# Altium schematic sheet ESP32-DEVKITC-32D.SchDoc
size A
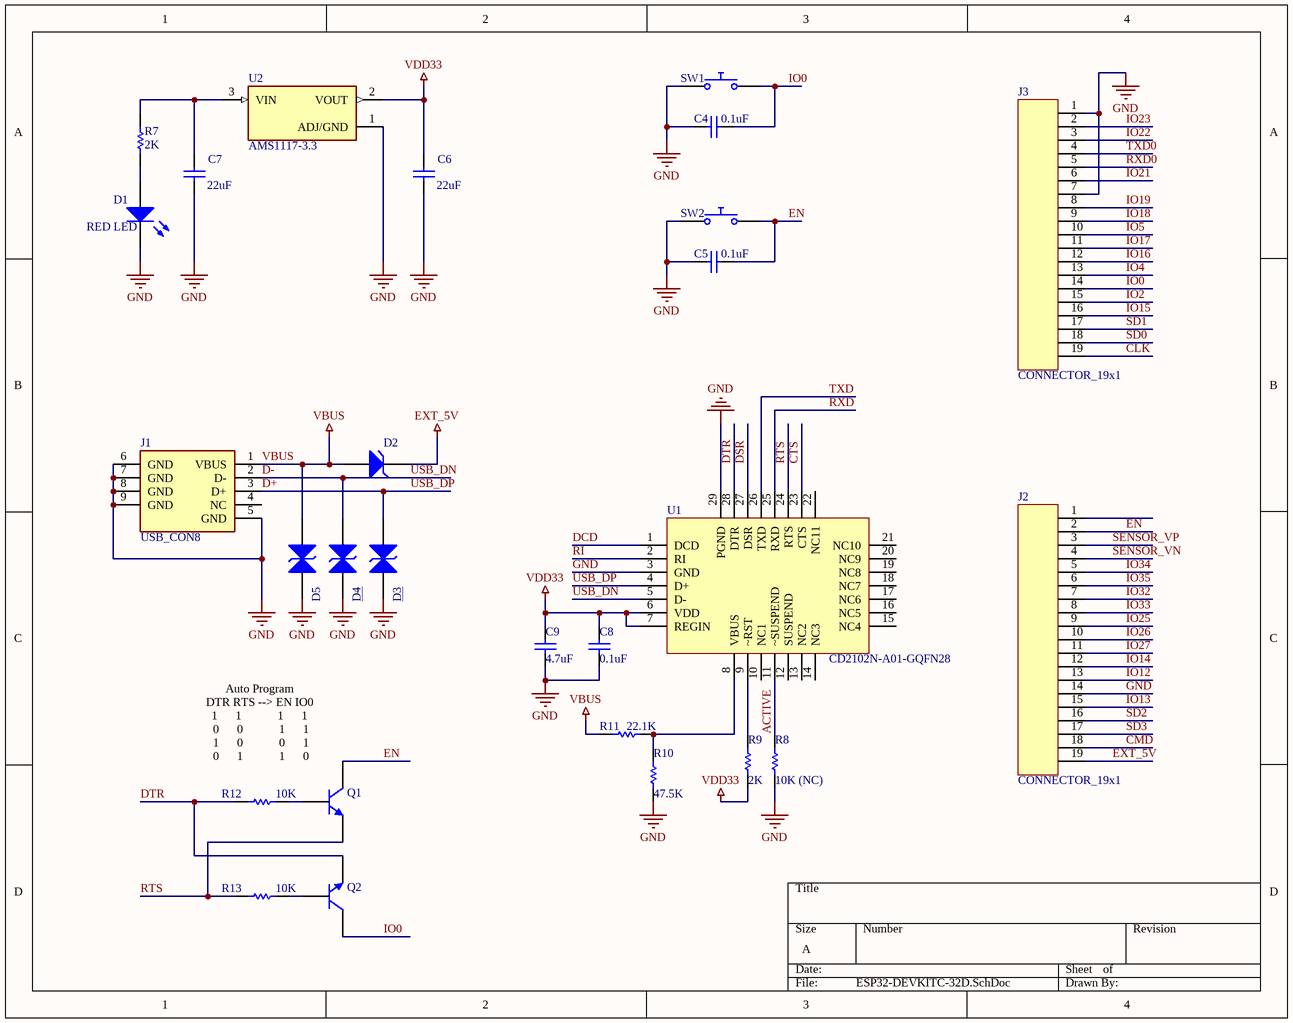
[diagram p0: ESP32-DEVKITC-32D.SchDoc]

## Parts
C4  value 0.1uF  (hidden comment: Capacitor)
C5  value 0.1uF  (hidden comment: Capacitor)
C6  value 22uF  (hidden comment: Capacitor)
C7  value 22uF  (hidden comment: Capacitor)
C8  value 0.1uF  (hidden comment: Capacitor)
C9  value 4.7uF  (hidden comment: Capacitor)
D1  RED LED
D2  Zener Diode  (value not drawn)
D3  Suppressor Dual  (value not drawn)
D4  Suppressor Dual  (value not drawn)
D5  Suppressor Dual  (value not drawn)
J1  USB_CON8
J2  CONNECTOR_19x1  [HDR1X19]
J3  CONNECTOR_19x1  [HDR1X19]
Q1  Bipolar  NPN 3 Pins  Transistor   Gummel-Poon Model  (value not drawn)
Q2  Bipolar  NPN 3 Pins  Transistor   Gummel-Poon Model  (value not drawn)
R7  value 2K  (hidden comment: Resistor)
R8  value 10K (NC)  (hidden comment: Resistor)
R9  value 2K  (hidden comment: Resistor)
R10  value 47.5K  (hidden comment: Resistor)
R11  value 22.1K  (hidden comment: Resistor)
R12  value 10K  (hidden comment: Resistor)
R13  value 10K  (hidden comment: Resistor)
SW1  Push Button Normally Opened  (value not drawn)
SW2  Push Button Normally Opened  (value not drawn)
U1  CD2102N-A01-GQFN28
U2  AMS1117-3.3  [SOT229P700X180-4N]

## Nets
EXT_5V: D2.2(K) J2.19
GND: C4.1 C5.1 C6.1 C7.1 C8.1 C9.1 D1.2(K) D3.1 D4.1 D5.1 J1.5(GND) J1.6(GND) J1.7(GND) J1.8(GND) J1.9(GND) J2.14 J3.1 J3.7 R8.1 R10.1 SW1.1 SW2.1 U1.3(GND) U1.29(PGND) U2.1(ADJ/GND)
VBUS: D2.1(A) D5.2 J1.1(VBUS) R11.2
VDD33: C6.2 C8.2 C9.2 R9.1 U1.6(VDD) U1.7(REGIN) U2.2(VOUT)
ACTIVE: R8.2 U1.11(~SUSPEND)
CLK: J3.19
CMD: J2.18
CTS: U1.23(CTS)
D+: D3.2 J1.3(D+) U1.4(D+)  [also labelled USB_DP]
D-: D4.2 J1.2(D-) U1.5(D-)  [also labelled USB_DN]
DCD: U1.1(DCD)
DSR: U1.27(DSR)
DTR: Q2.3(E) R12.2 U1.28(DTR)
EN: C5.2 J2.2 Q1.1(C) SW2.2
IO0: C4.2 J3.14 Q2.1(C) SW1.2
IO2: J3.15
IO4: J3.13
IO5: J3.10
IO12: J2.13
IO13: J2.15
IO14: J2.12
IO15: J3.16
IO16: J3.12
IO17: J3.11
IO18: J3.9
IO19: J3.8
IO21: J3.6
IO22: J3.3
IO23: J3.2
IO25: J2.9
IO26: J2.10
IO27: J2.11
IO32: J2.7
IO33: J2.8
IO34: J2.5
IO35: J2.6
RI: U1.2(RI)
RTS: Q1.3(E) R13.2 U1.24(RTS)
RXD: U1.25(RXD)
RXD0: J3.5
SD0: J3.18
SD1: J3.17
SD2: J2.16
SD3: J2.17
SENSOR_VN: J2.4
SENSOR_VP: J2.3
TXD: U1.26(TXD)
TXD0: J3.4
NetC7_2: C7.2 R7.2 U2.3(VIN)
NetD1_1: D1.1(A) R7.1
NetQ1_2: Q1.2(B) R12.1
NetQ2_2: Q2.2(B) R13.1
NetR9_2: R9.2 U1.9(~RST)
NetR10_2: R10.2 R11.1 U1.8(VBUS)

Not connected (* = marked no-connect by the designer): J1 4(NC); J2 1; U1 10(NC1) 12(SUSPEND) 13(NC2) 14(NC3) 15(NC4) 16(NC5) 17(NC6) 18(NC7) 19(NC8) 20(NC9) 21(NC10) 22(NC11)

## Notes on the sheet
- (near Q1) Auto Program
  DTR RTS --> EN IO0
  1      1            1      1
  0      0            1      1
  1      0            0      1
  0      1            1      0

## Library data of the parts
C4-C9 = Capacitor: SimulationGenericComponent: True
D1 = LED: Light-Emitting Diode; AF: 1; BV: 0; BV_MAX: 1e99; EG: 1.11; FC: 0.5; IBV: 0.001; IS: 1e-14; MJSW: 0.33; NTUN: 30; TNOM: 27; XTI: 3; SimulationGenericComponent: True; CJO: 0; CJP: 0; CTA: 0; CTP: 0; FCS: 0.5; FV_MAX: 1e99; IKF: 0; IKR: 0; ISR: 1e-14; JSW: 0; JTUN: 0; JTUNSW: 0; KEG: 1; KF: 0; LEVEL: 1; N: 1; NBV: 1; NR: 1; NS: 1; PHP: 1; RS: 0; TCV: 0; TLEV: 0; TLEVC: 0; TM1: 0; TM2: 0; TPB: 0; TPHP: 0; TRS: 0; TRS2: 0; TT: 0; TTT1: 0; TTT2: 0; VJ: 1; XTITUN: 3
D2 = Zener Diode: AF: 1; BV_MAX: 1e99; CJO: 0; EG: 1.11; FC: 0.5; IBV: 0.001; IS: 1e-14; MJSW: 0.33; NTUN: 30; TNOM: 27; XTI: 3; SimulationGenericComponent: True; BV: 100; CJP: 0; CTA: 0; CTP: 0; FCS: 0.5; FV_MAX: 1e99; IKF: 0; IKR: 0; ISR: 1e-14; JSW: 0; JTUN: 0; JTUNSW: 0; KEG: 1; KF: 0; LEVEL: 1; N: 1; NBV: 1; NR: 1; NS: 1; PHP: 1; RS: 0; TCV: 0; TLEV: 0; TLEVC: 0; TM1: 0; TM2: 0; TPB: 0; TPHP: 0; TRS: 0; TRS2: 0; TT: 0; TTT1: 0; TTT2: 0; VJ: 1; XTITUN: 3
D3-D5 = Suppressor Dual: area: 1; temp: 27; dtemp: 0; EG: 1.11; FC: 0.5; IBV: 100p; IS: 10f; NTUN: 30; XTITUN: 3; MJSW: 0.33; BV_MAX: 1e99; SimulationGenericComponent: True; m: 1; pj: 1; AF: 1; BV: 0; CJO: 0; IBVL: 0; IKF: 0; IKR: 0; JSW: 0; JTUN: 0; JTUNSW: 0; KEG: 1; CJP: 0; FCS: 0.5; PHP: 1; ISR: 0; KF: 0; N: 1; NBV: 1; NBVL: 1; NR: 1; NS: 1; RS: 0; TBV1: 0; TBV2: 0; TIKF: 0; TRS1: 0; TRS2: 0; TT: 0; VJ: 1; XTI: 3; TNOM: 27; TM1: 0; TM2: 0; TTT1: 0; TTT2: 0; TLEV: 0; TLEVC: 0; CTA: 0; CTP: 0; TCV: 0; TVJ: 0; TPHP: 0; FV_MAX: 1e99
J2 J3 = Header 19: Header, 19-Pin; LatestRevisionDate: 17-Jul-2002; LatestRevisionNote: Re-released for DXP Platform.; Publisher: Altium Limited
Q1 Q2 = BJT NPN_GP: SimulationGenericComponent: True; BF: 100; AF: 0; BR: 1; EG: 1.11; FC: 0.5; IS: 1e-16; MJC: 0.33; NC: 2; NE: 1.5; TNOM: 27; VBC_MAX: 1e99; VJC: 0.75; XTI: 3; CJC: 0; CJE: 0; CJS: 0; CTC: 0; CTE: 0; CTS: 0; IKF: 0; IKR: 0; IRB: 0; ISC: 0; ISE: 0; ISS: 0; ITF: 0; KF: 0; MJE: 0.33; MJS: 0; NF: 1; NKF: 0.5; NR: 1; NS: 1; PTF: 0; RB: 0; RBM: 0; RC: 0; RE: 0; SUBS: 1; TBF1: 0; TBF2: 0; TBR1: 0; TBR2: 0; TF: 0; TIKF1: 0; TIKF2: 0; TIKR1: 0; TIKR2: 0; TIRB1: 0; TIRB2: 0; TIS1: 0; TIS2: 0; TISC1: 0; TISC2: 0; TISE1: 0; TISE2: 0; TITF1: 0; TITF2: 0; TLEV: 0; TLEVC: 0; TMJC1: 0; TMJC2: 0; TMJE1: 0; TMJE2: 0; TMJS1: 0; TMJS2: 0; TNC1: 0; TNC2: 0; TNE1: 0; TNE2: 0; TNF1: 0; TNF2: 0; TNR1: 0; TNR2: 0; TNS1: 0; TNS2: 0; TR: 0; TRB1: 0; TRB2: 0; TRC1: 0; TRC2: 0; TRE1: 0; TRE2: 0; TRM1: 0; TRM2: 0; TTF1: 0; TTF2: 0; TTR1: 0; TTR2: 0; TVAF1: 0; TVAF2: 0; TVAR1: 0; TVAR2: 0; TVJC: 0; TVJE: 0; TVJS: 0; VAF: 0; VAR: 0; VBE_MAX: 1e99; VCE_MAX: 1e99; VJE: 0.75; VJS: 0.75; VTF: 0; XCJC: 1; XTB: 0; XTF: 0
R7-R13 = Resistor: TC1: 0; SimulationGenericComponent: True; TC2: 0
SW1 SW2 = Push Button NO: closed: 0; Rclosed: 1m; Ropen: 1Meg; SimulationGenericComponent: True
U2 = AMS1117-3.3: Linear Voltage Regulator IC Positive Fixed 1 Output 1A SOT-223-3L; MF: UMW; SnapEDA_Link: https://www.snapeda.com/parts/AMS1117-3.3/UMW/view-part/?ref=snap; Package: SOT-223-3L UMW; Value: *; MP: AMS1117-3.3; Check_prices: https://www.snapeda.com/parts/AMS1117-3.3/UMW/view-part/?ref=eda